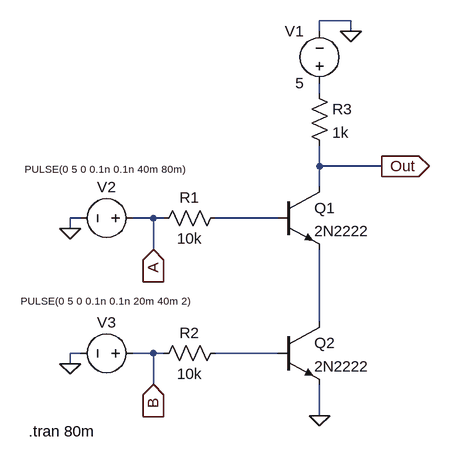
[diagram p0: schematic nand_gate.asc]
nand_gate.asc, the LTspice schematic file:
Version 4
SHEET 1 880 680
WIRE 400 -224 352 -224
WIRE 352 -208 352 -224
WIRE 400 -208 400 -224
WIRE 352 -112 352 -128
WIRE 352 0 352 -32
WIRE 448 0 352 0
WIRE 352 32 352 0
WIRE -16 80 -32 80
WIRE 96 80 64 80
WIRE 112 80 96 80
WIRE 288 80 192 80
WIRE -32 96 -32 80
WIRE 96 128 96 80
WIRE 352 240 352 128
WIRE -16 288 -32 288
WIRE 96 288 64 288
WIRE 112 288 96 288
WIRE 288 288 192 288
WIRE -32 304 -32 288
WIRE 96 336 96 288
WIRE 352 384 352 336
FLAG 352 384 0
FLAG 400 -208 0
FLAG -32 96 0
FLAG -32 304 0
FLAG 448 0 Out
IOPIN 448 0 Out
FLAG 96 128 A
IOPIN 96 128 In
FLAG 96 336 B
IOPIN 96 336 In
SYMBOL npn 288 32 R0
SYMATTR InstName Q1
SYMATTR Value 2N2222
SYMBOL npn 288 240 R0
SYMATTR InstName Q2
SYMATTR Value 2N2222
SYMBOL voltage 352 -112 R180
WINDOW 0 24 96 Left 2
WINDOW 3 24 16 Left 2
WINDOW 123 0 0 Left 0
WINDOW 39 0 0 Left 0
SYMATTR InstName V1
SYMATTR Value 5
SYMBOL res 208 64 R90
WINDOW 0 0 56 VBottom 2
WINDOW 3 32 56 VTop 2
SYMATTR InstName R1
SYMATTR Value 10k
SYMBOL res 208 272 R90
WINDOW 0 0 56 VBottom 2
WINDOW 3 32 56 VTop 2
SYMATTR InstName R2
SYMATTR Value 10k
SYMBOL voltage 80 80 R90
WINDOW 0 -32 56 VBottom 2
WINDOW 3 -86 61 VTop 1
WINDOW 123 0 0 Left 0
WINDOW 39 0 0 Left 0
SYMATTR InstName V2
SYMATTR Value PULSE(0 5 0 0.1n 0.1n 40m 80m)
SYMBOL voltage 80 288 R90
WINDOW 0 -32 56 VBottom 2
WINDOW 3 -91 60 VTop 1
WINDOW 123 0 0 Left 0
WINDOW 39 0 0 Left 0
SYMATTR InstName V3
SYMATTR Value PULSE(0 5 0 0.1n 0.1n 20m 40m 2)
SYMBOL res 336 -128 R0
SYMATTR InstName R3
SYMATTR Value 1k
TEXT -96 408 Left 2 !.tran 80m

The netlist it stands for:
* nand_gate.asc
Q1 Out N002 N003 0 2N2222
Q2 N003 N004 0 0 2N2222
V1 N001 0 5
R1 N002 A 10k
R2 N004 B 10k
V2 A 0 PULSE(0 5 0 0.1n 0.1n 40m 80m)
V3 B 0 PULSE(0 5 0 0.1n 0.1n 20m 40m 2)
R3 N001 Out 1k
.model NPN NPN
.model PNP PNP
.lib standard.bjt
.tran 80m
.backanno
.end

* Results of the author's LTspice run, read from the files saved beside the schematic
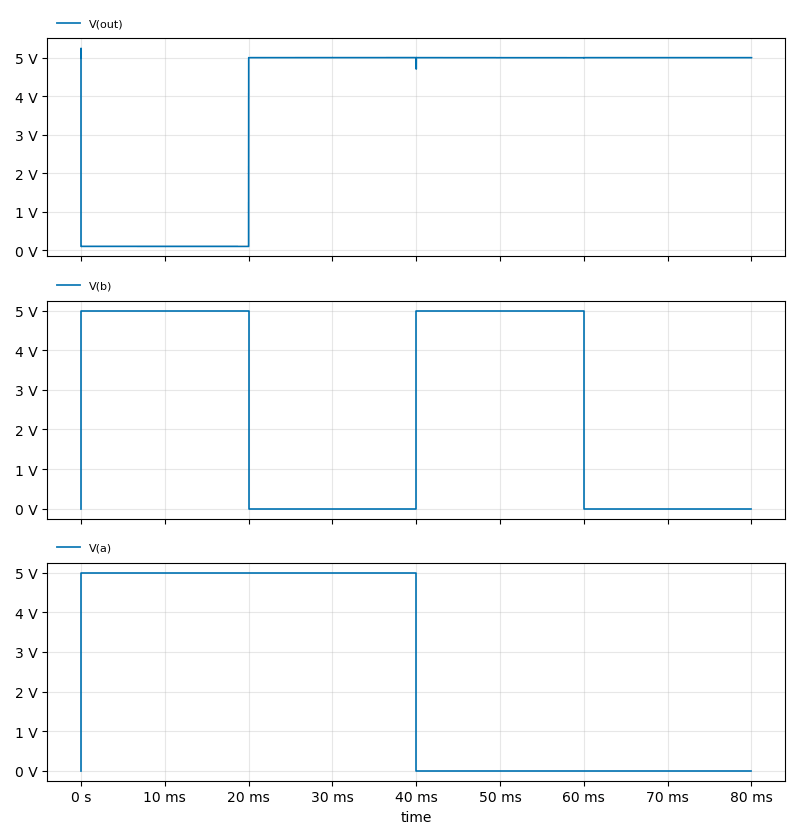
[diagram p1: Transient Analysis of nand_gate.asc, plotted from the saved traces]
* Transient Analysis, 1 run:
*   V(out): min 94.53 mV, max 5.242 V, average 3.774 V, rms 4.33 V, last 5 V
*   V(b): min 0 V, max 5 V, average 2.5 V, rms 3.536 V, last 0 V
*   V(a): min 0 V, max 5 V, average 2.5 V, rms 3.536 V, last 0 V